# EAGLE schematic nandboard-pcb_rev_d (EAGLE 7.7.0)
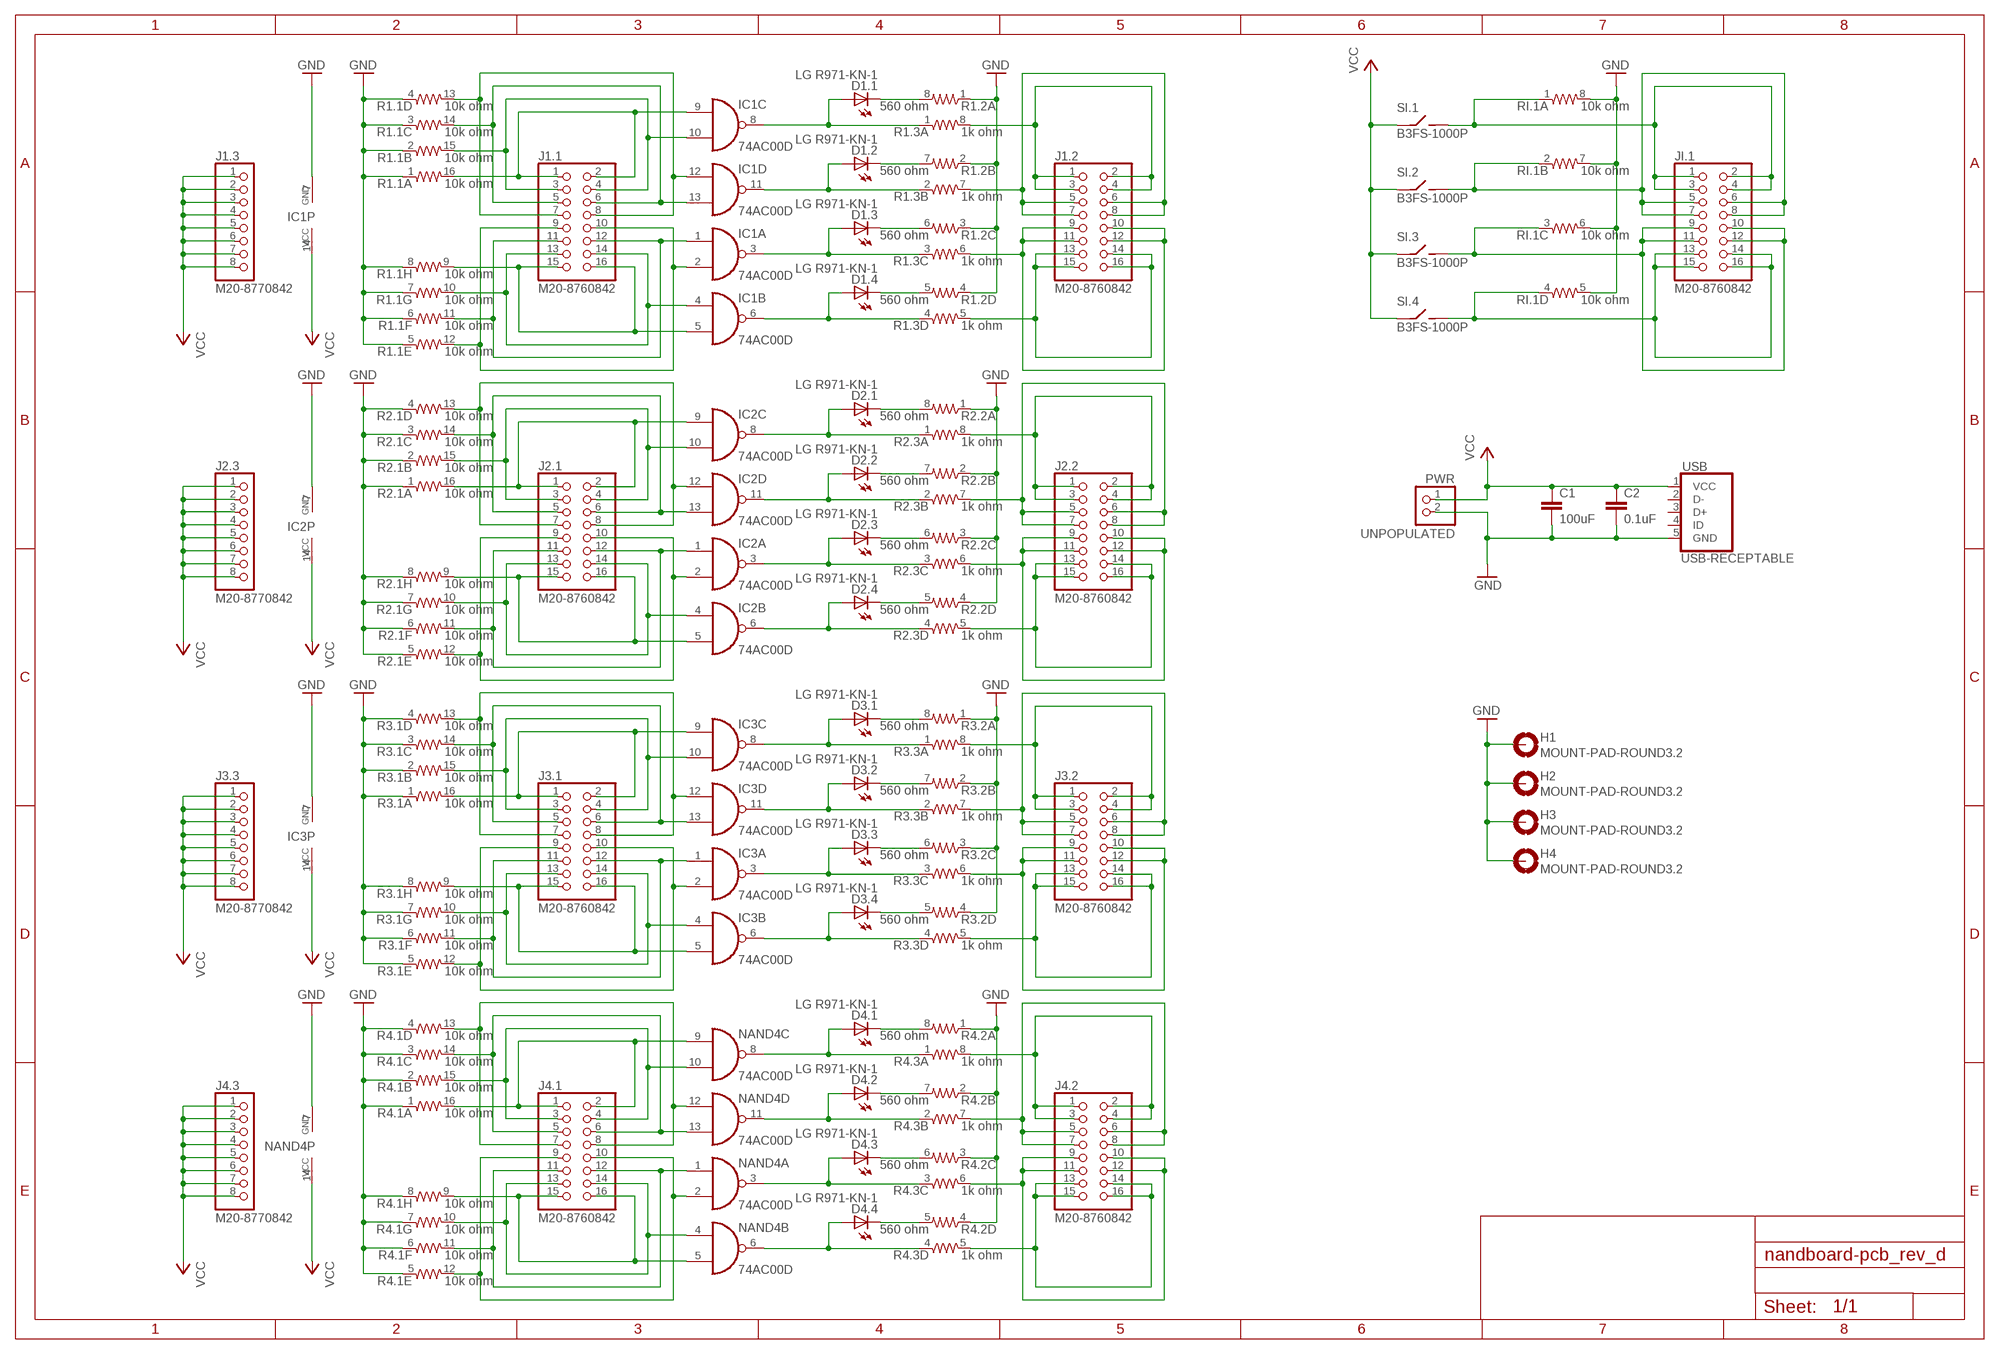
[diagram p0: schematic, sheet 1]

## Parts
C1  100uF  C-EUC1210  [C1210]
C2  0.1uF  C-EUC0805  [C0805]
D1.1  LG R971-KN-1  LEDCHIPLED_0805  [CHIPLED_0805]
D1.2  LG R971-KN-1  LEDCHIPLED_0805  [CHIPLED_0805]
D1.3  LG R971-KN-1  LEDCHIPLED_0805  [CHIPLED_0805]
D1.4  LG R971-KN-1  LEDCHIPLED_0805  [CHIPLED_0805]
D2.1  LG R971-KN-1  LEDCHIPLED_0805  [CHIPLED_0805]
D2.2  LG R971-KN-1  LEDCHIPLED_0805  [CHIPLED_0805]
D2.3  LG R971-KN-1  LEDCHIPLED_0805  [CHIPLED_0805]
D2.4  LG R971-KN-1  LEDCHIPLED_0805  [CHIPLED_0805]
D3.1  LG R971-KN-1  LEDCHIPLED_0805  [CHIPLED_0805]
D3.2  LG R971-KN-1  LEDCHIPLED_0805  [CHIPLED_0805]
D3.3  LG R971-KN-1  LEDCHIPLED_0805  [CHIPLED_0805]
D3.4  LG R971-KN-1  LEDCHIPLED_0805  [CHIPLED_0805]
D4.1  LG R971-KN-1  LEDCHIPLED_0805  [CHIPLED_0805]
D4.2  LG R971-KN-1  LEDCHIPLED_0805  [CHIPLED_0805]
D4.3  LG R971-KN-1  LEDCHIPLED_0805  [CHIPLED_0805]
D4.4  LG R971-KN-1  LEDCHIPLED_0805  [CHIPLED_0805]
H1  MOUNT-PAD-ROUND3.2  [3,2-PAD]
H2  MOUNT-PAD-ROUND3.2  [3,2-PAD]
H3  MOUNT-PAD-ROUND3.2  [3,2-PAD]
H4  MOUNT-PAD-ROUND3.2  [3,2-PAD]
IC1  74AC00D  [SO14]
IC2  74AC00D  [SO14]
IC3  74AC00D  [SO14]
J1.1  M20-8760842  PINHD-2X8SMT  [2X08_SMT]
J1.2  M20-8760842  PINHD-2X8SMT  [2X08_SMT]
J1.3  M20-8770842  PINHD-1X81X08_SMT  [1X08_SMT]
J2.1  M20-8760842  PINHD-2X8SMT  [2X08_SMT]
J2.2  M20-8760842  PINHD-2X8SMT  [2X08_SMT]
J2.3  M20-8770842  PINHD-1X81X08_SMT  [1X08_SMT]
J3.1  M20-8760842  PINHD-2X8SMT  [2X08_SMT]
J3.2  M20-8760842  PINHD-2X8SMT  [2X08_SMT]
J3.3  M20-8770842  PINHD-1X81X08_SMT  [1X08_SMT]
J4.1  M20-8760842  PINHD-2X8SMT  [2X08_SMT]
J4.2  M20-8760842  PINHD-2X8SMT  [2X08_SMT]
J4.3  M20-8770842  PINHD-1X81X08_SMT  [1X08_SMT]
JI.1  M20-8760842  PINHD-2X8SMT  [2X08_SMT]
NAND4  74AC00D  [SO14]
PWR  UNPOPULATED  PINHD-1X2  [1X02]
R1.1  10k ohm  742-16_S  [742-16]
R1.2  560 ohm  742-8_S  [742-8]
R1.3  1k ohm  742-8_S  [742-8]
R2.1  10k ohm  742-16_S  [742-16]
R2.2  560 ohm  742-8_S  [742-8]
R2.3  1k ohm  742-8_S  [742-8]
R3.1  10k ohm  742-16_S  [742-16]
R3.2  560 ohm  742-8_S  [742-8]
R3.3  1k ohm  742-8_S  [742-8]
R4.1  10k ohm  742-16_S  [742-16]
R4.2  560 ohm  742-8_S  [742-8]
R4.3  1k ohm  742-8_S  [742-8]
RI.1  10k ohm  742-8_S  [742-8]
SI.1  B3FS-1000P  SPSTB3FS-1000  [B3FS-1000]
SI.2  B3FS-1000P  SPSTB3FS-1000  [B3FS-1000]
SI.3  B3FS-1000P  SPSTB3FS-1000  [B3FS-1000]
SI.4  B3FS-1000P  SPSTB3FS-1000  [B3FS-1000]
USB  USB-RECEPTABLE  [FCI-10103594-0001LF]

## Nets
GND: C1.2 C2.2 H1.B3,2(MOUNT) H2.B3,2(MOUNT) H3.B3,2(MOUNT) H4.B3,2(MOUNT) IC1.7(P:GND) IC2.7(P:GND) IC3.7(P:GND) NAND4.7(P:GND) PWR.2 R1.1.1 R1.1.2 R1.1.3 R1.1.4 R1.1.5 R1.1.6 R1.1.7 R1.1.8 R1.2.1 R1.2.2 R1.2.3 R1.2.4 R2.1.1 R2.1.2 R2.1.3 R2.1.4 R2.1.5 R2.1.6 R2.1.7 R2.1.8 R2.2.1 R2.2.2 R2.2.3 R2.2.4 R3.1.1 R3.1.2 R3.1.3 R3.1.4 R3.1.5 R3.1.6 R3.1.7 R3.1.8 R3.2.1 R3.2.2 R3.2.3 R3.2.4 R4.1.1 R4.1.2 R4.1.3 R4.1.4 R4.1.5 R4.1.6 R4.1.7 R4.1.8 R4.2.1 R4.2.2 R4.2.3 R4.2.4 RI.1.5 RI.1.6 RI.1.7 RI.1.8 USB.5(GND)
N$1: IC2.9(C:I0) J2.1.1 J2.1.2 R2.1.16
N$2: IC2.10(C:I1) J2.1.3 J2.1.4 R2.1.15
N$3: JI.1.1 JI.1.2 JI.1.3 JI.1.4 RI.1.1 SI.1.3(B) SI.1.4(B)
N$4: IC2.13(D:I1) J2.1.5 J2.1.6 R2.1.14
N$5: IC2.12(D:I0) J2.1.7 J2.1.8 R2.1.13
N$6: JI.1.5 JI.1.6 JI.1.7 JI.1.8 RI.1.2 SI.2.3(B) SI.2.4(B)
N$7: JI.1.9 JI.1.10 JI.1.11 JI.1.12 RI.1.3 SI.3.3(B) SI.3.4(B)
N$8: JI.1.13 JI.1.14 JI.1.15 JI.1.16 RI.1.4 SI.4.3(B) SI.4.4(B)
N$9: IC2.5(B:I1) J2.1.15 J2.1.16 R2.1.9
N$10: IC2.4(B:I0) J2.1.13 J2.1.14 R2.1.10
N$11: IC2.1(A:I0) J2.1.11 J2.1.12 R2.1.11
N$12: IC2.2(A:I1) J2.1.9 J2.1.10 R2.1.12
N$13: D1.4.C R1.2.5
N$14: D1.3.C R1.2.6
N$15: D1.2.C R1.2.7
N$16: D1.1.C R1.2.8
N$17: J2.2.13 J2.2.14 J2.2.15 J2.2.16 R2.3.5
N$18: J2.2.9 J2.2.10 J2.2.11 J2.2.12 R2.3.6
N$19: J2.2.1 J2.2.2 J2.2.3 J2.2.4 R2.3.8
N$20: J2.2.5 J2.2.6 J2.2.7 J2.2.8 R2.3.7
N$21: IC1.9(C:I0) J1.1.1 J1.1.2 R1.1.16
N$22: IC1.10(C:I1) J1.1.3 J1.1.4 R1.1.15
N$23: IC1.13(D:I1) J1.1.5 J1.1.6 R1.1.14
N$24: IC1.12(D:I0) J1.1.7 J1.1.8 R1.1.13
N$25: J1.2.13 J1.2.14 J1.2.15 J1.2.16 R1.3.5
N$26: J1.2.9 J1.2.10 J1.2.11 J1.2.12 R1.3.6
N$27: D1.1.A IC1.8(C:O) R1.3.1
N$28: J1.2.1 J1.2.2 J1.2.3 J1.2.4 R1.3.8
N$29: IC1.5(B:I1) J1.1.15 J1.1.16 R1.1.9
N$30: IC1.4(B:I0) J1.1.13 J1.1.14 R1.1.10
N$31: IC1.1(A:I0) J1.1.11 J1.1.12 R1.1.11
N$32: IC1.2(A:I1) J1.1.9 J1.1.10 R1.1.12
N$33: D1.2.A IC1.11(D:O) R1.3.2
N$34: J1.2.5 J1.2.6 J1.2.7 J1.2.8 R1.3.7
N$35: D1.3.A IC1.3(A:O) R1.3.3
N$36: D1.4.A IC1.6(B:O) R1.3.4
N$37: D2.1.A IC2.8(C:O) R2.3.1
N$38: D2.2.A IC2.11(D:O) R2.3.2
N$39: D2.3.A IC2.3(A:O) R2.3.3
N$40: D2.4.A IC2.6(B:O) R2.3.4
N$41: D2.1.C R2.2.8
N$42: D2.2.C R2.2.7
N$43: D2.3.C R2.2.6
N$44: D2.4.C R2.2.5
N$45: IC3.9(C:I0) J3.1.1 J3.1.2 R3.1.16
N$46: IC3.10(C:I1) J3.1.3 J3.1.4 R3.1.15
N$47: IC3.13(D:I1) J3.1.5 J3.1.6 R3.1.14
N$48: IC3.12(D:I0) J3.1.7 J3.1.8 R3.1.13
N$49: IC3.5(B:I1) J3.1.15 J3.1.16 R3.1.9
N$50: IC3.4(B:I0) J3.1.13 J3.1.14 R3.1.10
N$51: IC3.1(A:I0) J3.1.11 J3.1.12 R3.1.11
N$52: IC3.2(A:I1) J3.1.9 J3.1.10 R3.1.12
N$53: J3.2.13 J3.2.14 J3.2.15 J3.2.16 R3.3.5
N$54: J3.2.9 J3.2.10 J3.2.11 J3.2.12 R3.3.6
N$55: J3.2.1 J3.2.2 J3.2.3 J3.2.4 R3.3.8
N$56: J3.2.5 J3.2.6 J3.2.7 J3.2.8 R3.3.7
N$57: D3.1.A IC3.8(C:O) R3.3.1
N$58: D3.2.A IC3.11(D:O) R3.3.2
N$59: D3.3.A IC3.3(A:O) R3.3.3
N$60: D3.4.A IC3.6(B:O) R3.3.4
N$61: D3.4.C R3.2.5
N$62: D3.3.C R3.2.6
N$63: D3.2.C R3.2.7
N$64: D3.1.C R3.2.8
N$65: J4.1.1 J4.1.2 NAND4.9(C:I0) R4.1.16
N$66: J4.1.3 J4.1.4 NAND4.10(C:I1) R4.1.15
N$67: J4.1.5 J4.1.6 NAND4.13(D:I1) R4.1.14
N$68: J4.1.7 J4.1.8 NAND4.12(D:I0) R4.1.13
N$69: J4.1.15 J4.1.16 NAND4.5(B:I1) R4.1.9
N$70: J4.1.13 J4.1.14 NAND4.4(B:I0) R4.1.10
N$71: J4.1.11 J4.1.12 NAND4.1(A:I0) R4.1.11
N$72: J4.1.9 J4.1.10 NAND4.2(A:I1) R4.1.12
N$73: J4.2.13 J4.2.14 J4.2.15 J4.2.16 R4.3.5
N$74: J4.2.9 J4.2.10 J4.2.11 J4.2.12 R4.3.6
N$75: J4.2.1 J4.2.2 J4.2.3 J4.2.4 R4.3.8
N$76: J4.2.5 J4.2.6 J4.2.7 J4.2.8 R4.3.7
N$77: D4.1.A NAND4.8(C:O) R4.3.1
N$78: D4.2.A NAND4.11(D:O) R4.3.2
N$79: D4.3.A NAND4.3(A:O) R4.3.3
N$80: D4.4.A NAND4.6(B:O) R4.3.4
N$81: D4.1.C R4.2.8
N$82: D4.2.C R4.2.7
N$83: D4.3.C R4.2.6
N$84: D4.4.C R4.2.5
VCC: C1.1 C2.1 IC1.14(P:VCC) IC2.14(P:VCC) IC3.14(P:VCC) J1.3.1 J1.3.2 J1.3.3 J1.3.4 J1.3.5 J1.3.6 J1.3.7 J1.3.8 J2.3.1 J2.3.2 J2.3.3 J2.3.4 J2.3.5 J2.3.6 J2.3.7 J2.3.8 J3.3.1 J3.3.2 J3.3.3 J3.3.4 J3.3.5 J3.3.6 J3.3.7 J3.3.8 J4.3.1 J4.3.2 J4.3.3 J4.3.4 J4.3.5 J4.3.6 J4.3.7 J4.3.8 NAND4.14(P:VCC) PWR.1 SI.1.1(A) SI.1.2(A) SI.2.1(A) SI.2.2(A) SI.3.1(A) SI.3.2(A) SI.4.1(A) SI.4.2(A) USB.1(VCC)
Unconnected: USB.2(D-) USB.3(D+) USB.4(ID)

## Library data of the parts
C1 C2 = rcl:C-EU: CAPACITOR, European symbol
D1.1-D1.4 D2.1-D2.4 D3.1-D3.4 D4.1-D4.4 = led:LED: LED OSRAM: - CHIPLED LG R971, LG N971, LY N971, LG Q971, LY Q971, LO R971, LY R971 LH N974, LH R974 LS Q976, LO Q976, LY Q976 LO Q996 - Hyper CHIPLED LW Q18S LB Q993, LB Q99A, LB R99A - SideLED LS A670, LO A670, LY A670, LG A670, LP A670 LB A673, LV A673, LT A673, LW A673 LH A674 LY A675 LS A676, LA A676, LO A676, LY A676, LW A676 LS A679, LY A679, LG A679 - Hyper Micro SIDELED® LS Y876, LA Y876, LO Y876, LY Y876 LT Y87S - SmartLED LW L88C, LW L88S LB L89C, LB L89S, LG L890 LS L89K, LO L89K, LY L89K LS L896, LA L896, LO L896, LY L896 - TOPLED LS T670, LO T670, LY T670, LG T670, LP T670 LSG T670, LSP T670, LSY T670, LOP T670, LYG T670 LG T671, LOG T671, LSG T671 LB T673, LV T673, LT T673, LW T673 LH T674 LS T676, LA T676, LO T676, LY T676, LB T676, LH T676, LSB T676, LW T676 LB T67C, LV T67C, LT T67C, LS T67K, LO T67K, LY T67K, LW E67C LS E67B, LA E67B, LO E67B, LY E67B, LB E67C, LV E67C, LT E67C LW T67C LS T679, LY T679, LG T679 LS T770, LO T770, LY T770, LG T770, LP T770 LB T773, LV T773, LT T773, LW T773 LH T774 LS E675, LA E675, LY E675, LS T675 LS T776, LA T776, LO T776, LY T776, LB T776 LHGB T686 LT T68C, LB T68C - Hyper Mini TOPLED® LB M676 - Mini TOPLED Santana® LG M470 LS M47K, LO M47K, LY M47K Source: http://www.osram.convergy.de LUXEON: - LUMILED® LXK2-PW12-R00, LXK2-PW12-S00, LXK2-PW14-U00, LXK2-PW14-V00 LXK2-PM12-R00, LXK2-PM12-S00, LXK2-PM14-U00 LXK2-PE12-Q00, LXK2-PE12-R00, LXK2-PE12-S00, LXK2-PE14-T00, LXK2-PE14-U00 LXK2-PB12-K00, LXK2-PB12-L00, LXK2-PB12-M00, LXK2-PB14-N00, LXK2-PB14-P00, LXK2-PB14-Q00 LXK2-PR12-L00, LXK2-PR12-M00, LXK2-PR14-Q00, LXK2-PR14-R00 LXK2-PD12-Q00, LXK2-PD12-R00, LXK2-PD12-S00 LXK2-PH12-R00, LXK2-PH12-S00 LXK2-PL12-P00, LXK2-PL12-Q00, LXK2-PL12-R00 Source: www.luxeon.com KINGBRIGHT: KA-3528ASYC Source: www.kingbright.com
H1-H4 = holes:MOUNT-PAD-ROUND: MOUNTING PAD, round
IC1-IC3 NAND4 = 74xx-eu:74*00: Quad 2-input NAND gate
J1.1 J1.2 J2.1 J2.2 J3.1 J3.2 J4.1 J4.2 JI.1 = pinhead+:PINHD-2X8: PIN HEADER
J1.3 J2.3 J3.3 J4.3 = pinhead+:PINHD-1X8: PIN HEADER
PWR = pinhead:PINHD-1X2: PIN HEADER
R1.1 R2.1 R3.1 R4.1 = resistor-array:742-16_S: CTS 742 Series 16 Terminations, 8 Resistors
R1.2 R1.3 R2.2 R2.3 R3.2 R3.3 R4.2 R4.3 RI.1 = resistor-array:742-8_S: CTS 742 Series 8 Terminations, 4 Resistors
SI.1-SI.4 = PP_Electromechanical:SPST: SPST Switches
USB = daspilker:USB-RECEPTABLE: USB Receptable